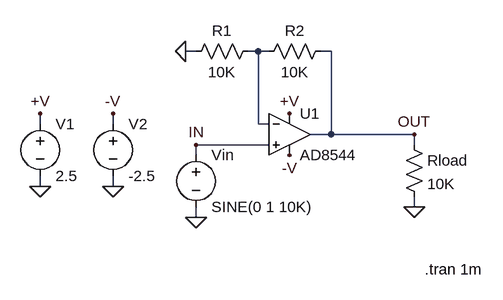
[diagram p0: schematic AD8544.asc]
AD8544.asc, the LTspice schematic file:
Version 4
SHEET 1 1240 700
WIRE 64 -1072 48 -1072
WIRE 160 -1072 144 -1072
WIRE 176 -1072 160 -1072
WIRE 272 -1072 256 -1072
WIRE -176 -960 -176 -976
WIRE -64 -960 -64 -976
WIRE 160 -960 160 -1072
WIRE 176 -960 160 -960
WIRE 272 -944 272 -1072
WIRE 272 -944 240 -944
WIRE 400 -944 272 -944
WIRE 176 -928 64 -928
WIRE 400 -928 400 -944
WIRE 64 -912 64 -928
WIRE -176 -864 -176 -880
WIRE -64 -864 -64 -880
WIRE 400 -832 400 -848
WIRE 64 -816 64 -832
FLAG -176 -976 +V
FLAG -176 -864 0
FLAG 64 -816 0
FLAG 400 -944 OUT
FLAG 64 -928 IN
FLAG 208 -976 +V
FLAG -64 -976 -V
FLAG 208 -912 -V
FLAG 48 -1072 0
FLAG 400 -832 0
FLAG -64 -864 0
SYMBOL Opamps\\AD8544 208 -1008 R0
SYMATTR InstName U1
SYMBOL voltage -176 -976 R0
WINDOW 123 0 0 Left 2
WINDOW 39 0 0 Left 2
SYMATTR InstName V1
SYMATTR Value 2.5
SYMBOL voltage 64 -928 R0
WINDOW 123 24 146 Left 2
WINDOW 39 24 125 Left 2
SYMATTR InstName Vin
SYMATTR Value SINE(0 1 10K)
SYMBOL res 160 -1088 R90
WINDOW 0 0 56 VBottom 2
WINDOW 3 32 56 VTop 2
SYMATTR InstName R1
SYMATTR Value 10K
SYMBOL res 272 -1088 R90
WINDOW 0 0 56 VBottom 2
WINDOW 3 32 56 VTop 2
SYMATTR InstName R2
SYMATTR Value 10K
SYMBOL voltage -64 -976 R0
WINDOW 123 24 146 Left 2
WINDOW 39 24 125 Left 2
SYMATTR InstName V2
SYMATTR Value -2.5
SYMBOL res 384 -944 R0
SYMATTR InstName Rload
SYMATTR Value 10K
TEXT 416 -736 Left 2 !.tran 1m

The netlist it stands for:
* AD8544.asc
XU1 IN N001 +V -V OUT AD8544  ; pins In+ In- V+ V- OUT
V1 +V 0 2.5
Vin IN 0 SINE(0 1 10K)
R1 N001 0 10K
R2 OUT N001 10K
V2 -V 0 -2.5
Rload OUT 0 10K
.tran 1m
.backanno
.end